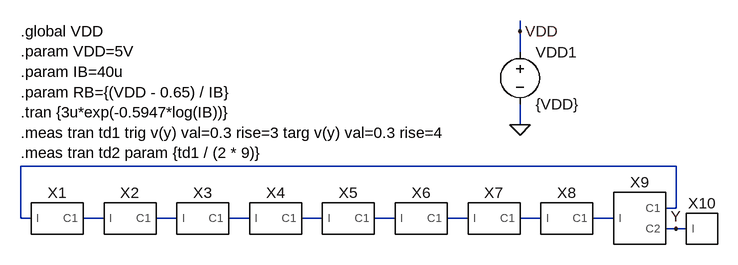
[diagram p0: schematic tb_ringosc9.asc]
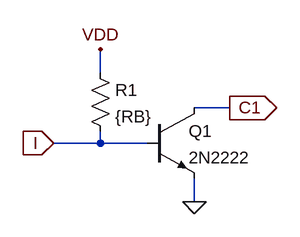
[diagram p1: sub-circuit iilg1.asc]
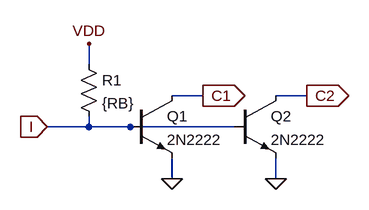
[diagram p2: sub-circuit iilg2.asc]
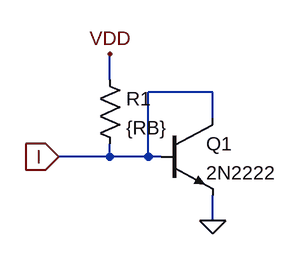
[diagram p3: sub-circuit iilout.asc]
tb_ringosc9.asc, the LTspice schematic file:
Version 4
SHEET 1 964 680
WIRE 656 112 656 96
WIRE 656 144 656 112
WIRE 656 256 656 224
WIRE 896 320 -112 320
WIRE 896 384 896 320
WIRE 896 384 880 384
WIRE -112 400 -112 320
WIRE -96 400 -112 400
WIRE 16 400 -16 400
WIRE 128 400 96 400
WIRE 240 400 208 400
WIRE 352 400 320 400
WIRE 464 400 432 400
WIRE 576 400 544 400
WIRE 688 400 656 400
WIRE 800 400 768 400
WIRE 896 416 880 416
WIRE 912 416 896 416
FLAG 656 256 0
FLAG 656 112 VDD
FLAG 896 416 Y
SYMBOL voltage 656 128 R0
SYMATTR InstName VDD1
SYMATTR Value {VDD}
SYMBOL iilg1 -64 400 R0
SYMATTR InstName X1
SYMBOL iilg1 48 400 R0
SYMATTR InstName X2
SYMBOL iilg1 160 400 R0
SYMATTR InstName X3
SYMBOL iilg1 272 400 R0
SYMATTR InstName X4
SYMBOL iilg1 384 400 R0
SYMATTR InstName X5
SYMBOL iilg1 496 400 R0
SYMATTR InstName X6
SYMBOL iilg1 608 400 R0
SYMATTR InstName X7
SYMBOL iilg1 720 400 R0
SYMATTR InstName X8
SYMBOL iilg2 832 400 R0
SYMATTR InstName X9
SYMBOL iilout 928 416 R0
SYMATTR InstName X10
TEXT -112 112 Left 2 !.global VDD\n.param VDD=5V\n.param IB=40u\n.param RB={(VDD - 0.65) / IB}\n.tran {3u*exp(-0.5947*log(IB))}\n.meas tran td1 trig v(y) val=0.3 rise=3 targ v(y) val=0.3 rise=4\n.meas tran td2 param {td1 / (2 * 9)}

iilg1.asc, the sub-circuit schematic file:
Version 4
SHEET 1 880 680
WIRE 384 240 384 208
WIRE 560 288 512 288
WIRE 384 336 384 320
WIRE 384 336 320 336
WIRE 448 336 384 336
WIRE 512 416 512 384
FLAG 512 416 0
FLAG 384 208 VDD
FLAG 320 336 I
IOPIN 320 336 In
FLAG 560 288 C1
IOPIN 560 288 Out
SYMBOL npn 448 288 R0
SYMATTR InstName Q1
SYMATTR Value 2N2222
SYMBOL res 368 224 R0
SYMATTR InstName R1
SYMATTR Value {RB}

iilg2.asc, the sub-circuit schematic file:
Version 4
SHEET 1 880 680
WIRE 384 240 384 208
WIRE 560 288 512 288
WIRE 720 288 672 288
WIRE 384 336 384 320
WIRE 384 336 320 336
WIRE 448 336 384 336
WIRE 608 336 448 336
WIRE 512 416 512 384
WIRE 672 416 672 384
FLAG 384 208 VDD
FLAG 320 336 I
IOPIN 320 336 In
FLAG 512 416 0
FLAG 560 288 C1
IOPIN 560 288 Out
FLAG 672 416 0
FLAG 720 288 C2
IOPIN 720 288 Out
SYMBOL npn 448 288 R0
SYMATTR InstName Q1
SYMATTR Value 2N2222
SYMBOL res 368 224 R0
SYMATTR InstName R1
SYMATTR Value {RB}
SYMBOL npn 608 288 R0
SYMATTR InstName Q2
SYMATTR Value 2N2222

iilout.asc, the sub-circuit schematic file:
Version 4
SHEET 1 880 680
WIRE 48 208 48 176
WIRE 176 224 96 224
WIRE 176 256 176 224
WIRE 48 304 48 288
WIRE 48 304 -16 304
WIRE 96 304 96 224
WIRE 96 304 48 304
WIRE 112 304 96 304
WIRE 176 384 176 352
FLAG 176 384 0
FLAG 48 176 VDD
FLAG -16 304 I
IOPIN -16 304 In
SYMBOL npn 112 256 R0
SYMATTR InstName Q1
SYMATTR Value 2N2222
SYMBOL res 32 192 R0
SYMATTR InstName R1
SYMATTR Value {RB}

The netlist it stands for:
* tb_ringosc9.asc
VDD1 VDD 0 {VDD}
XX1 N001 N002 iilg1
XX2 N002 N003 iilg1
XX3 N003 N004 iilg1
XX4 N004 N005 iilg1
XX5 N005 N006 iilg1
XX6 N006 N007 iilg1
XX7 N007 N008 iilg1
XX8 N008 N009 iilg1
XX9 N009 N001 Y iilg2
XX10 Y iilout

* block symbol definitions
.subckt iilg1 I C1
Q1 C1 I 0 0 2N2222
R1 VDD I {RB}
.ends iilg1

.subckt iilg2 I C1 C2
Q1 C1 I 0 0 2N2222
R1 VDD I {RB}
Q2 C2 I 0 0 2N2222
.ends iilg2

.subckt iilout I
Q1 I I 0 0 2N2222
R1 VDD I {RB}
.ends iilout

.model NPN NPN
.model PNP PNP
.lib standard.bjt
.global VDD
.param VDD=5V
.param IB=40u
.param RB={(VDD - 0.65) / IB}
.tran {3u*exp(-0.5947*log(IB))}
.meas tran td1 trig v(y) val=0.3 rise=3 targ v(y) val=0.3 rise=4
.meas tran td2 param {td1 / (2 * 9)}
.backanno
.end